# EAGLE design custom_i2c_controller (EAGLE 9.6.2)
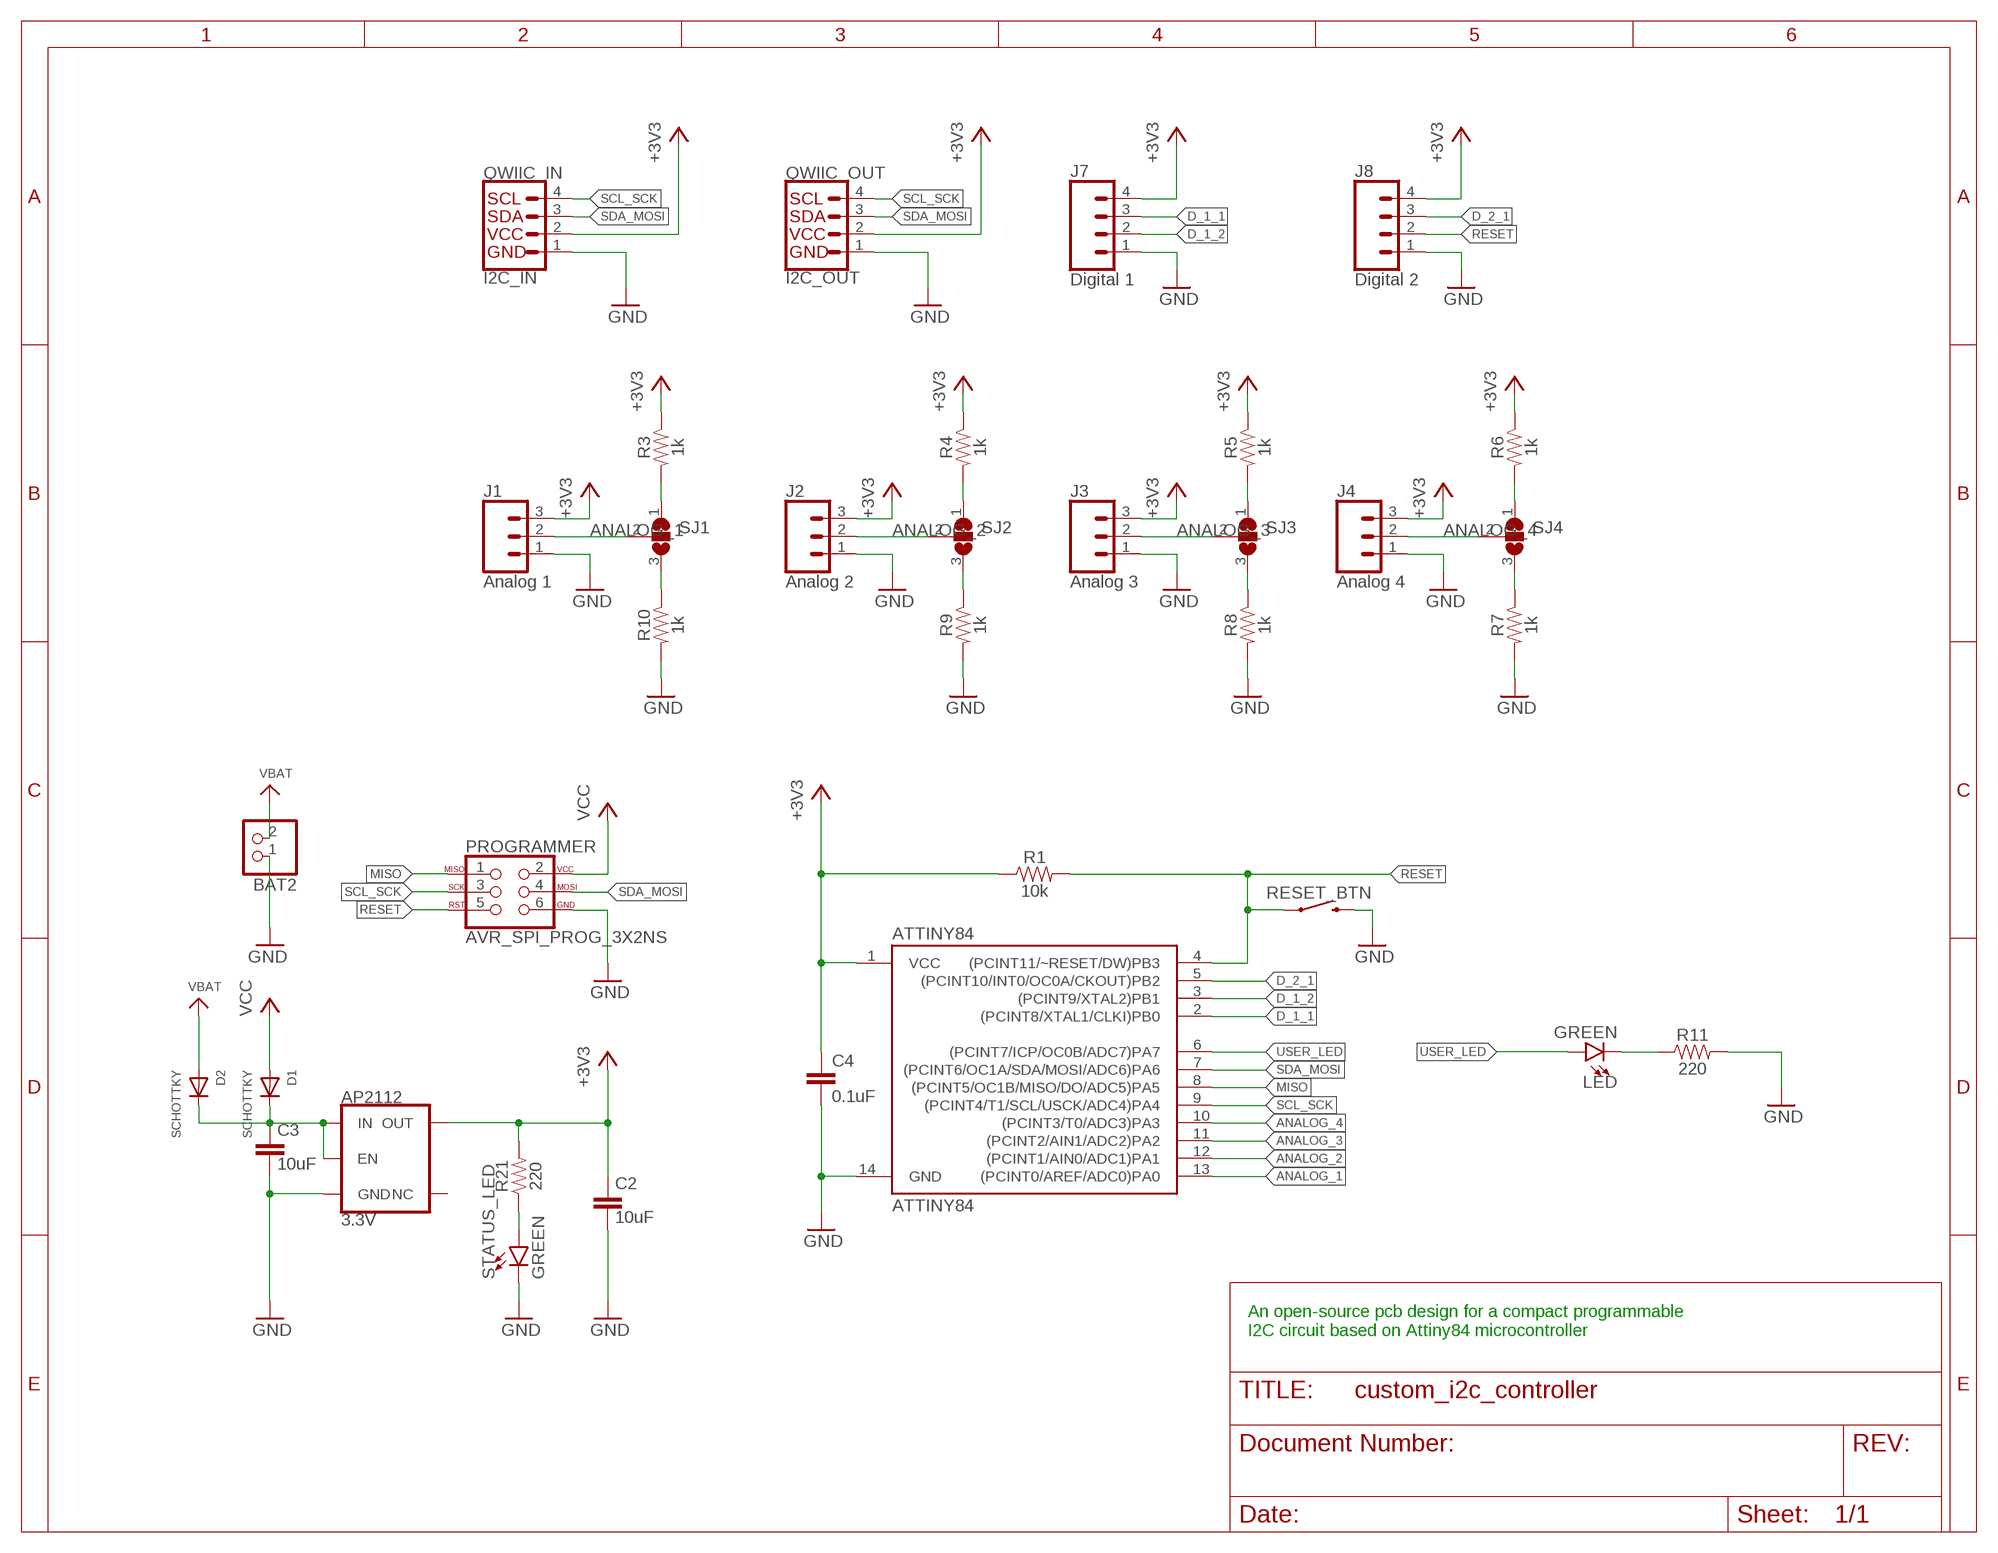
[diagram p0: schematic, sheet 1]

## Parts
AP2112  3.3V  V_REG_AP2112K-3.3V  [SOT23-5]
ATTINY84  ATTINY84  [SO14]
BAT2  CON_JST_PH_2PINSH2  [JSTSH2]
C2  10uF  10UF-1206-6.3V-20%  [1206]
C3  10uF  10UF-1206-6.3V-20%  [1206]
C4  0.1uF  0.1UF-0603-25V-5%  [0603]
D1  SCHOTTKY  DIODE_SOD-123FL  [SOD-123FL]
D2  SCHOTTKY  DIODE_SOD-123FL  [SOD-123FL]
J1  Analog 1  CONN_03  [1X03]
J2  Analog 2  CONN_03  [1X03]
J3  Analog 3  CONN_03  [1X03]
J4  Analog 4  CONN_03  [1X03]
J7  Digital 1  CONN_04  [1X04]
J8  Digital 2  CONN_04  [1X04]
LED  GREEN  LED-GREEN0603  [LED-0603]
PROGRAMMER  AVR_SPI_PROG_3X2NS  [2X3-NS]
QWIIC_IN  I2C_IN  QWIIC_CONNECTORJS-1MM  [1X04_1MM_RA]
QWIIC_OUT  I2C_OUT  QWIIC_CONNECTORJS-1MM  [1X04_1MM_RA]
R1  10k  10KOHM-0603-1/10W-1%  [0603]
R3  1k  1KOHM-0603-1/10W-1%  [0603]
R4  1k  1KOHM-0603-1/10W-1%  [0603]
R5  1k  1KOHM-0603-1/10W-1%  [0603]
R6  1k  1KOHM-0603-1/10W-1%  [0603]
R7  1k  1KOHM-0603-1/10W-1%  [0603]
R8  1k  1KOHM-0603-1/10W-1%  [0603]
R9  1k  1KOHM-0603-1/10W-1%  [0603]
R10  1k  1KOHM-0603-1/10W-1%  [0603]
R11  220  220OHM-0603-1/10W-1%  [0603]
R21  220  220OHM-0603-1/10W-1%  [0603]
RESET_BTN  MOMENTARY-SWITCH-SPST-SMD-6.0X3.5MM  [TACTILE_SWITCH_SMD_6.0X3.5MM]
SJ1  SJ2W  [SJ_2]
SJ2  SJ2W  [SJ_2]
SJ3  SJ2W  [SJ_2]
SJ4  SJ2W  [SJ_2]
STATUS_LED  GREEN  LED-GREEN0603  [LED-0603]

## Nets
+3V3: AP2112.5(OUT) ATTINY84.1(VCC) C2.1 C4.1 J1.3 J2.3 J3.3 J4.3 J7.4 J8.4 QWIIC_IN.2(VCC) QWIIC_OUT.2(VCC) R1.1 R3.1 R4.1 R5.1 R6.1 R21.2
ANALOG_1: ATTINY84.13((PCINT0/AREF/ADC0)PA0) J1.2 SJ1.2
ANALOG_2: ATTINY84.12((PCINT1/AIN0/ADC1)PA1) J2.2 SJ2.2
ANALOG_3: ATTINY84.11((PCINT2/AIN1/ADC2)PA2) J3.2 SJ3.2
ANALOG_4: ATTINY84.10((PCINT3/T0/ADC3)PA3) J4.2 SJ4.2
D_1_1: ATTINY84.2((PCINT8/XTAL1/CLKI)PB0) J7.3
D_1_2: ATTINY84.3((PCINT9/XTAL2)PB1) J7.2
D_2_1: ATTINY84.5((PCINT10/INT0/OC0A/CKOUT)PB2) J8.3
GND: AP2112.2(GND) ATTINY84.14(GND) BAT2.1 C2.2 C3.2 C4.2 J1.1 J2.1 J3.1 J4.1 J7.1 J8.1 PROGRAMMER.6 QWIIC_IN.1(GND) QWIIC_OUT.1(GND) R7.2 R8.2 R9.2 R10.2 R11.2 RESET_BTN.2 STATUS_LED.C
MISO: ATTINY84.8((PCINT5/OC1B/MISO/DO/ADC5)PA5) PROGRAMMER.1
N$1: R7.1 SJ4.3
N$2: R6.2 SJ4.1
N$3: R8.1 SJ3.3
N$4: R5.2 SJ3.1
N$5: R4.2 SJ2.1
N$6: R9.1 SJ2.3
N$7: R10.1 SJ1.3
N$8: R3.2 SJ1.1
N$9: R21.1 STATUS_LED.A
N$10: AP2112.1(IN) AP2112.3(EN) C3.1 D1.C D2.C
N$11: LED.C R11.1
RESET: ATTINY84.4((PCINT11/~RESET/DW)PB3) J8.2 PROGRAMMER.5 R1.2 RESET_BTN.1
SCL_SCK: ATTINY84.9((PCINT4/T1/SCL/USCK/ADC4)PA4) PROGRAMMER.3 QWIIC_IN.4(SCL) QWIIC_OUT.4(SCL)
SDA_MOSI: ATTINY84.7((PCINT6/OC1A/SDA/MOSI/ADC6)PA6) PROGRAMMER.4 QWIIC_IN.3(SDA) QWIIC_OUT.3(SDA)
USER_LED: ATTINY84.6((PCINT7/ICP/OC0B/ADC7)PA7) LED.A
VBAT: BAT2.2 D2.A
VCC: D1.A PROGRAMMER.2
Unconnected: AP2112.4(NC)

## Notes on the sheet
- An open-source pcb design for a compact programmable 
  I2C circuit based on Attiny84 microcontroller

## Library data of the parts
AP2112 = SparkFun-IC-Power:V_REG_AP2112: AP2112 - 600mA CMOS LDO Regulator w/ Enable The AP2112 is CMOS process low dropout linear regulator with enable function, the regulator delivers a guaranteed 600mA (min.) continuous load current. Features Output Voltage Accuracy: ±1.5% Output Current: 600mA (Min.) Foldback Short Current Protection: 50mA Enable Function to Turn ON/OFF VOUT Low Dropout Voltage (3.3V): 250mV (Typ.) @IOUT=600mA Excellent Load Regulation: 0.2%/A (Typ.) Excellent Line Regulation: 0.02%/V (Typ.) Low Quiescent Current: 55μA (Typ.) Low Standby Current: 0.01μA (Typ.) Low Output Noise: 50μVRMS PSRR: 100Hz -65dB, 1kHz -65dB OTSD Protection Stable with 1.0μF Flexible Cap: Ceramic, Tantalum and Aluminum Electrolytic Operation Temperature Range: -40°C to 85°C ESD: MM 400V, HBM 4000V; PROD_ID: VREG-12457
ATTINY84 = SparkFun-IC-Microcontroller:ATTINY84: Atmel 14-pin 2/4/8kB flash uC Datasheet <https://cdn.sparkfun.com/datasheets/Widgets/doc8006.pdf> SparkFun Products Tiny AVR Programmer <https://www.sparkfun.com/products/11801> (PGM-11801) SparkFun Servo Trigger - Continuous Rotation <https://www.sparkfun.com/products/13872> (WIG-13872) SparkFun Servo Trigger <https://www.sparkfun.com/products/13118> (WIG-13118); PROD_ID: IC-11285
BAT2 = microbuilder:CON_JST_PH_2PIN: JST 2-Pin Right-Angle Connector PH-Series - 4UConnector: 17311 SH-Series - 4UConnector: 07278
C2 C3 = SparkFun-Capacitors:10UF: 10.0µF ceramic capacitors A capacitor is a passive two-terminal electrical component used to store electrical energy temporarily in an electric field.; PROD_ID: CAP-10057
C4 = SparkFun-Capacitors:0.1UF: 0.1µF ceramic capacitors A capacitor is a passive two-terminal electrical component used to store electrical energy temporarily in an electric field.; PROD_ID: CAP-08604
D1 D2 = adafruit:DIODE: Diode SMADIODE - SMA Surface Mount Package 20V 1A Schottky Diode Digikey: 641-1014-6-ND DO-1N4148 - Through Hole Small Current Diode SOD-123 20V 1 A (.5mV Vf) Schottky Diode - Digikey: MBRX120TPMSCT-ND SOD-323 10V 570mA (.38mV Vf, 3ns) Schottky Diode - Digikey: ZLLS410CT-ND SOD-523 30V 30mA Schottky Diode (RB751S-40TE61) - Digikey: RB751S-40TE61CT-ND SOT23-R/W - SOT23 Package (R = Solder Paste/Reflow Ovens, W = Hand-Soldering) BAT54Film 40V 300mA - Digikey: 497-7162-1-ND
J1-J4 = SparkFun-Connectors:CONN_03: Multi connection point. Often used as Generic Header-pin footprint for 0.1 inch spaced/style header connections On any of the 0.1 inch spaced packages, you can populate with these: Break Away Headers - Straight <https://www.sparkfun.com/products/116> (PRT-00116) Break Away Male Headers - Right Angle <https://www.sparkfun.com/products/553> (PRT-00553) Female Headers <https://www.sparkfun.com/products/115> (PRT-00115) Break Away Headers - Machine Pin <https://www.sparkfun.com/products/117> (PRT-00117) Break Away Female Headers - Swiss Machine Pin <https://www.sparkfun.com/products/743> (PRT-00743) Stackable Header - 3 Pin (Female, 0.1") <https://www.sparkfun.com/products/13875> (PRT-13875) For SCREWTERMINALS and SPRING TERMINALS visit here: Screw Terimnals on SparkFun.com <https://www.sparkfun.com/search/results?term=Screw+Terminals> (5mm/3.5mm/2.54mm spacing) This device is also useful as a general connection point to wire up your design to another part of your project. Our various solder wires solder well into these plated through hole pads. Hook-Up Wire - Assortment (Stranded, 22 AWG) <https://www.sparkfun.com/products/11375> (PRT-11375) Hook-Up Wire - Assortment (Solid Core, 22 AWG) <https://www.sparkfun.com/products/11367> (PRT-11367) View the entire wire category on our website here <https://www.sparkfun.com/categories/141> Special notes: Molex polarized connector foot print use with SKU : PRT-08232 with associated crimp pins and housings.
J7 J8 = SparkFun-Connectors:CONN_04: Multi connection point. Often used as Generic Header-pin footprint for 0.1 inch spaced/style header connections On any of the 0.1 inch spaced packages, you can populate with these: Break Away Headers - Straight <https://www.sparkfun.com/products/116> (PRT-00116) Break Away Male Headers - Right Angle <https://www.sparkfun.com/products/553> (PRT-00553) Female Headers <https://www.sparkfun.com/products/115> (PRT-00115) Break Away Headers - Machine Pin <https://www.sparkfun.com/products/117> (PRT-00117) Break Away Female Headers - Swiss Machine Pin <https://www.sparkfun.com/products/743> (PRT-00743) For SCREWTERMINALS and SPRING TERMINALS visit here: Screw Terimnals on SparkFun.com <https://www.sparkfun.com/search/results?term=Screw+Terminals> (5mm/3.5mm/2.54mm spacing) This device is also useful as a general connection point to wire up your design to another part of your project. Our various solder wires solder well into these plated through hole pads. Hook-Up Wire - Assortment (Stranded, 22 AWG) <https://www.sparkfun.com/products/11375> (PRT-11375) Hook-Up Wire - Assortment (Solid Core, 22 AWG) <https://www.sparkfun.com/products/11367> (PRT-11367) View the entire wire category on our website here <https://www.sparkfun.com/categories/141> Special notes: Molex polarized connector foot print use with SKU : PRT-08231 with associated crimp pins and housings. 1MM SMD Version SKU: PRT-10208; PROD_ID: CONN-09696
LED STATUS_LED = SparkFun-LED:LED-GREEN: Green SMD LED Used in manufacturing of various products at SparkFun Packages: 0603 - SMD 0603 package [Product Link] <http://www.futureelectronics.com/en/technologies/semiconductors/optoelectronics/leds/Pages/9894312-LTST-C190GKT.aspx?CrossPart=HSMG-C190&IM=0> LilyPad 1206 - SMD1206 LilyPad package [Product Link] <http://www.futureelectronics.com/en/Technologies/Product.aspx?ProductID=IN150NGHARVATEKCORPORATION2049943&IM=0> 1206 - SMD1206 package [Product Link] <http://www.futureelectronics.com/en/technologies/semiconductors/optoelectronics/leds/Pages/8315665-LTST-C150KGKT.aspx?IM=0> 1206 Bottom Mount -SMD 1206 Bottom Mount [Product Link] <http://www.digikey.com/product-detail/en/lite-on-inc/LTST-C230KGKT/160-1456-1-ND/386854> SparkFun Products: Pro Mini 328 -5V <https://www.sparkfun.com/products/821> RedBoard <https://www.sparkfun.com/products/12757> MP3 Trigger <https://www.sparkfun.com/products/13720> Makey Makey <https://www.sparkfun.com/products/11076>; PROD_ID: DIO-00821
PROGRAMMER = SparkFun-Connectors:AVR_SPI_PROG_3X2: AVR ISP 6 Pin This is the reduced ISP connector for AVR programming. Common on Arduino. This footprint will take up less PCB space and can be used with a 10-pin to 6-pin adapter such as SKU: BOB-08508 **Special note about "TEST_POINT" package. The stop mask is on the top side, so if you want your programming test points to be on the bottom of your board, make sure to place this package on the bottom side of the board. This also ensure that the orientation to program from the bottom side will be correct. SparkFun Products: SparkFun ISP Pogo Adapter <https://www.sparkfun.com/products/11591> - NS Tiny AVR Programmer <https://www.sparkfun.com/products/11801> -PTH
QWIIC_IN QWIIC_OUT = SparkFun-Connectors:QWIIC_CONNECTOR: SparkFun I2C Standard Qwiic Connector An SMD 1mm pitch JST connector makes it easy and quick (get it? Qwiic?) to connect I2C devices to each other. The Qwiic system <http://www.sparkfun.com/qwiic> enables fast and solderless connection between popular platforms and various sensors and actuators. We carry 200mm <https://www.sparkfun.com/products/14204>, 100mm <https://www.sparkfun.com/products/14205>, 50mm <https://www.sparkfun.com/products/14206>, and breadboard friendly <https://www.sparkfun.com/products/14207> Qwiic cables. We also offer 10 pcs strips <https://www.sparkfun.com/products/14323> the SMD connectors.
R1 = SparkFun-Resistors:10KOHM: 10kΩ resistor A resistor is a passive two-terminal electrical component that implements electrical resistance as a circuit element. Resistors act to reduce current flow, and, at the same time, act to lower voltage levels within circuits. - Wikipedia; PROD_ID: RES-00824
R3-R10 = SparkFun-Resistors:1KOHM: 1kΩ resistor A resistor is a passive two-terminal electrical component that implements electrical resistance as a circuit element. Resistors act to reduce current flow, and, at the same time, act to lower voltage levels within circuits. - Wikipedia; PROD_ID: RES-07856
R11 R21 = SparkFun-Resistors:220OHM: 220Ω resistor A resistor is a passive two-terminal electrical component that implements electrical resistance as a circuit element. Resistors act to reduce current flow, and, at the same time, act to lower voltage levels within circuits. - Wikipedia; PROD_ID: RES-07861
RESET_BTN = SparkFun-Switches:MOMENTARY-SWITCH-SPST: Momentary Switch (Pushbutton) - SPST Normally-open (NO) SPST momentary switches (buttons, pushbuttons). Variants PTH-12MM - 12mm square, through-hole Momentary Pushbutton Switch - 12mm Square <https://www.sparkfun.com/products/9190> (COM-09190) PTH-6.0MM, PTH-6.0MM-KIT - 6.0mm square, through-hole Mini Pushbutton Switch <https://www.sparkfun.com/products/97> (COM-00097) KIT package intended for soldering kit's - only one side of pads' copper is exposed. PTH-RIGHT-ANGLE-KIT - Right-angle, through-hole Right Angle Tactile Button <https://www.sparkfun.com/products/10791> - Used on SparkFun BigTime Watch Kit <https://www.sparkfun.com/products/11734> SMD-12MM - 12mm square, surface-mount Tactile Button - SMD (12mm) <https://www.sparkfun.com/products/12993> (COM-12993) Used on SparkFun PicoBoard <https://www.sparkfun.com/products/11888> SMD-4.5MM - 4.5mm Square Trackball Switch Used on SparkFun Blackberry Trackballer Breakout <https://www.sparkfun.com/products/13169> SMD-4.6MMX2.8MM - 4.60mm x 2.80mm, surface mount Used on SparkFun SAMD21 Mini Breakout <https://www.sparkfun.com/products/13664> SMD-5.2MM, SMD-5.2-REDUNDANT - 5.2mm square, surface-mount Mini Pushbutton Switch - SMD <https://www.sparkfun.com/products/8720> (COM-08720) Used on Arduino Pro Mini <https://www.sparkfun.com/products/11114> REDUNDANT package connects both switch circuits together SMD-6.0X3.5MM - 6.0 x 3.5mm, surface mount Momentary Reset Switch SMD <https://www.sparkfun.com/products/8229> (COM-08229) SMD-6.2MM-TALL - 6.2mm square, surface mount Tactile Button - SMD (6mm) <https://www.sparkfun.com/products/12992> Used on SparkFun Digital Sandbox <https://www.sparkfun.com/products/12651> SMD-RIGHT-ANGLE - Right-angle, surface mount Used on SparkFun Block for Intel® Edison - Arduino <https://www.sparkfun.com/products/13036>; PROD_ID: SWCH-00815; SF_SKU: COM-08229
SJ1-SJ4 = jumper:SJ2W: SMD solder JUMPER

## Board
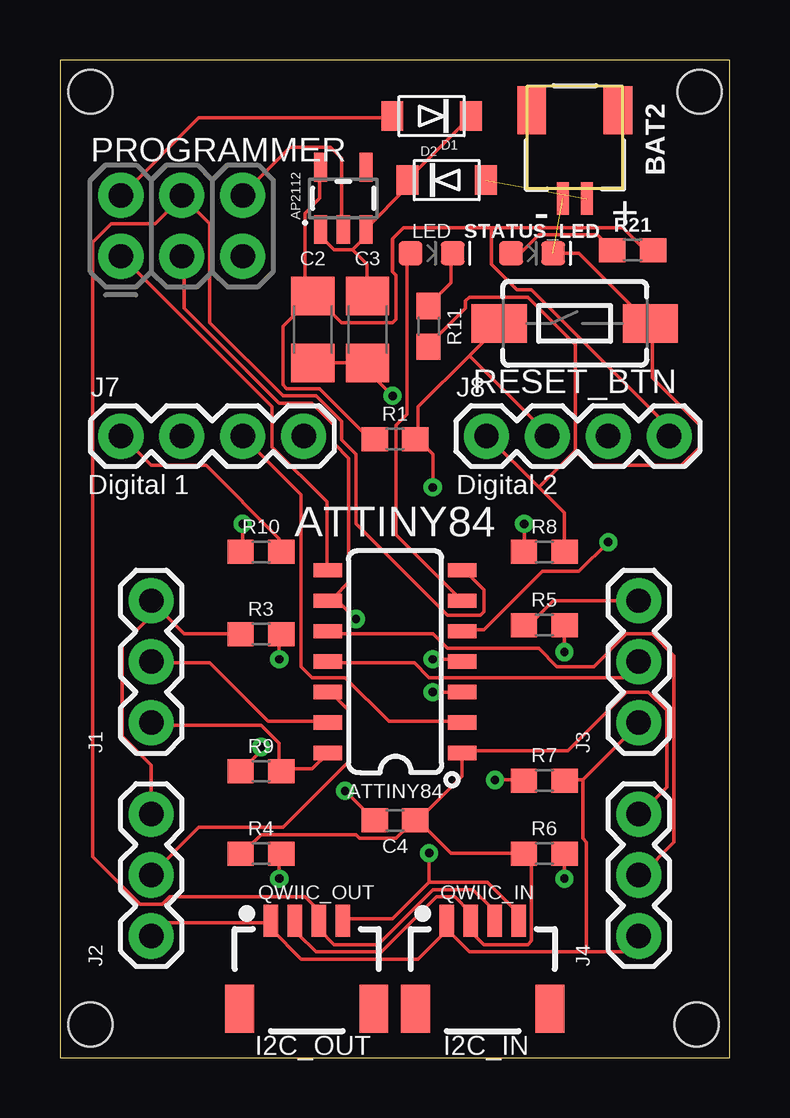
[diagram p1: board, top side]
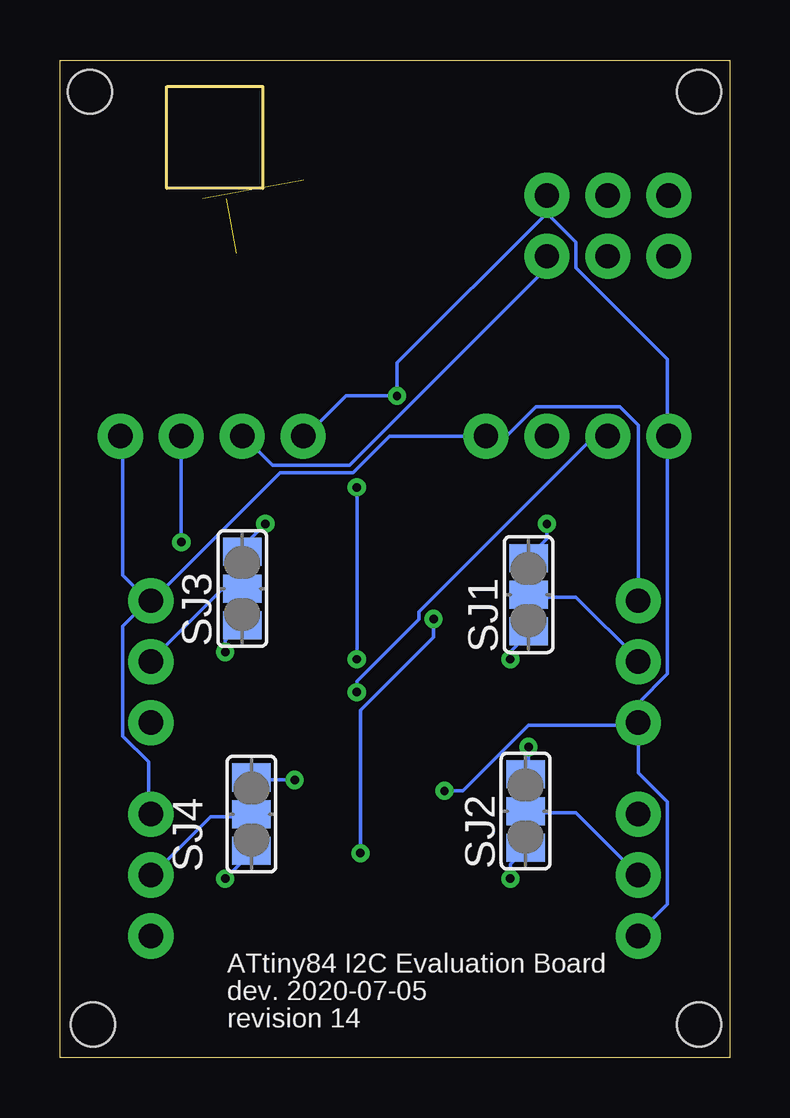
[diagram p2: board, bottom side, seen from below]

Size 27.92 x 41.58 mm. Coordinates in mm from the lower left corner, seen from the top.
Outline: 0,0 27.92,0 27.92,41.58 0,41.58 0,0
Copper layers (1*16): Top 0.035mm / dielectric 1.5mm / Bottom 0.035mm
Design rules "default": minimum track width 6mil, minimum drill 0.35mm, track to track 6mil, track to pad 6mil, pad to pad 6mil, via to via 6mil, smd to smd 6mil, copper to edge 40mil, drill to drill 6mil, minimum pad ring 10mil, minimum via ring 8mil, stop-mask expansion 4mil, vias tented up to drill 0mil, thermal gap 10mil
Holes 1.83 mm at 1.27,40.26 26.67,40.26 1.27,1.4 26.54,1.4

### Footprints (pad centres in the part's own frame; a part is rotated, then mirrored left to right if it is on the bottom)
SOT23-5 = smd 0.55 x 1.2: 1 -0.95,-1.3; 2 0,-1.3; 3 0.95,-1.3; 4 0.95,1.3; 5 -0.95,1.3
SO14 = smd 0.6 x 1.2: 1 -3.175,-2.8; 2 -1.905,-2.8; 3 -0.635,-2.8; 4 0.635,-2.8; 5 1.905,-2.8; 6 3.175,-2.8; 7 4.445,-2.8; 8 4.445,2.8; 9 3.175,2.8; 10 1.905,2.8; 11 0.635,2.8; 12 -0.635,2.8; 13 -1.905,2.8; 14 -3.175,2.8
JSTSH2 = smd 0.5 x 1.35: 1 -0.5,-2.55; 2 0.5,-2.55 | smd 1.2 x 2: NC1 -1.8,1.125; NC2 1.8,1.125
1206 = smd 1.6 x 1.8: 1 -1.4,0; 2 1.4,0
0603 = smd 1.1 x 1: 1 -0.85,0; 2 0.85,0
SOD-123FL = smd 0.91 x 1.22: A 1.637,0; C -1.637,0
1X03 = drill 1.016 pad 1.88: 1 0,0; 2 2.54,0; 3 5.08,0
1X04 = drill 1.016 pad 1.88: 1 0,0; 2 2.54,0; 3 5.08,0; 4 7.62,0
LED-0603 = smd 1 x 1: A -0.877,0; C 0.877,0
2X3-NS = drill 1.016 pad 1.88: 1 -2.54,-1.27; 2 -2.54,1.27; 3 0,-1.27; 4 0,1.27; 5 2.54,-1.27; 6 2.54,1.27
1X04_1MM_RA = smd 0.6 x 1.35: 1 -1.5,0; 2 -0.5,0; 3 0.5,0; 4 1.5,0 | smd 1.2 x 2: NC1 2.8,-3.675; NC2 -2.8,-3.675
TACTILE_SWITCH_SMD_6.0X3.5MM = smd 2.3 x 1.6: 1 -3.15,0; 2 3.15,0
SJ_2 = smd 1.168 x 1.6: 1 -1.524,0; 2 0,0; 3 1.524,0

### Placement (x,y rotation side)
AP2112  11.81,35.81 0 top
ATTINY84  13.97,15.88 90 top
BAT2  21.46,38.35 0 top
C2  10.54,30.35 270 top
C3  12.83,30.35 270 top
C4  13.97,9.91 180 top
D1  15.49,39.24 180 top
D2  16.13,36.58 0 top
J1  3.81,13.97 90 top
J2  3.81,5.08 90 top
J3  24.13,13.97 90 top
J4  24.13,5.08 90 top
J7  2.54,25.91 0 top
J8  17.78,25.91 0 top
LED  15.49,33.53 0 top
PROGRAMMER  5.08,34.67 0 top
QWIIC_IN  17.63,5.71 0 top
QWIIC_OUT  10.29,5.71 0 top
R1  13.97,25.78 0 top
R3  8.38,17.65 0 top
R4  8.38,8.51 0 top
R5  20.19,18.03 0 top
R6  20.19,8.51 0 top
R7  20.19,11.56 0 top
R8  20.19,21.08 0 top
R9  8.38,11.94 0 top
R10  8.38,21.08 0 top
R11  15.37,30.48 270 top
R21  23.88,33.66 0 top
RESET_BTN  21.46,30.61 0 top
SJ1  8.38,19.3 90 bottom
SJ2  8.51,10.29 90 bottom
SJ3  20.32,19.56 90 bottom
SJ4  19.94,10.16 90 bottom
STATUS_LED  19.68,33.53 0 top

### Tracks (layer width: path | path; a pad name or v marks a point on that pad's centre or on a via)
+3V3
  Top 0.152: 4.12,18.75 5.18,17.68 7.47,17.68 R3.1 | J2.3 3.81,12.19 2.59,13.41 2.59,17.22 4.12,18.75 | 4.12,18.75 J1.3 | R1.1 13.11,25.91 12.8,25.91 10.82,27.89 9.45,27.89 9.3,28.04 9.3,30.48 10.52,31.7 C2.1 | 17.98,34.59 14.33,34.59 13.87,34.14 13.87,32.77 14.02,32.61 14.02,30.79 13.87,30.63 11.73,30.63 10.67,31.7 C2.1 | 17.98,34.59 23.47,34.59 24.38,33.68 24.69,33.68 R21.2 | AP2112.5 10.82,37.03 10.82,35.81 10.21,35.2 10.21,32.16 10.52,31.85 C2.1 | QWIIC_OUT.2 9.91,5.64 9.91,5.18 10.67,4.42 13.41,4.42 15.7,6.71 16.46,6.71 17.07,6.1 17.07,5.79 QWIIC_IN.2 17.22,5.64 17.22,5.18 17.68,4.72 19.51,4.72 19.66,4.88 19.66,8.08 19.36,8.38 R6.1 19.2,8.53 16.31,8.53 14.94,9.91 | R4.1 7.62,8.53 8.38,9.3 12.34,9.3 12.5,9.14 14.02,9.14 14.78,9.91 C4.1 14.94,9.91 | 14.94,9.91 16.76,11.73 16.76,12.65 ATTINY84.1 16.92,12.8 21.18,12.8 23.62,15.24 24.54,15.24 25.3,14.48 25.3,11.28 24.23,10.21 J4.3 | J3.3 20.57,19.05 19.66,18.14 19.36,18.14 R5.1 | 17.98,34.59 17.98,33.07 19.05,32 19.66,32 25.3,26.36 25.3,25.91 J8.4
  Bottom 0.152: J1.3 3.81,26.36 4.57,27.13 8.08,27.13 9.3,25.91 J7.4 14.17,25.91 15.7,24.38 18.75,24.38 24.08,19.05 J3.3 24.23,19.05 | 24.23,19.05 25.3,17.98 25.3,13.41 24.23,12.34 24.23,10.21 J4.3 | 24.23,19.05 25.3,20.12 25.3,25.91 J8.4
ANALOG_1
  Top 0.152: ATTINY84.13 11.12,14.02 8.69,14.02 6.25,16.46 3.81,16.46 J1.2
  Bottom 0.152: SJ1.2 8.38,19.2 6.4,19.2 3.81,16.61 J1.2
ANALOG_2
  Top 0.152: J2.2 5.79,9.6 9.3,9.6 12.04,12.34 12.04,14.48 11.28,15.24 ATTINY84.12
  Bottom 0.152: J2.2 6.4,10.21 8.38,10.21 SJ2.2
ANALOG_3
  Top 0.152: J3.2 23.47,15.85 15.39,15.85 14.78,16.46 11.28,16.46 ATTINY84.11
  Bottom 0.152: SJ3.2 20.42,19.51 21.18,19.51 24.08,16.61 J3.2
ANALOG_4
  Top 0.152: ATTINY84.10 11.28,17.68 15.54,17.68 16.15,17.07 19.96,17.07 20.73,16.31 22.25,16.31 23.62,17.68 24.69,17.68 25.6,16.76 25.6,8.99 24.23,7.62 J4.2
  Bottom 0.152: SJ4.2 19.96,10.06 21.64,10.06 24.08,7.62 J4.2
D_1_1
  Top 0.152: J7.3 10.06,23.47 10.06,16.31 10.52,15.85 11.89,15.85 13.72,14.02 16.76,14.02 ATTINY84.2
D_1_2  (via drill 0.35)
  Top 0.152: v15.54,15.24 ATTINY84.3
  Bottom 0.152: v15.54,15.24 15.54,15.7 12.95,18.29 12.95,18.59 5.64,25.91 J7.2
D_2_1  (via drill 0.35)
  Top 0.152: v22.86,21.49 21.64,20.27 20.12,20.27 17.68,17.83 16.92,17.83 ATTINY84.5
  Bottom 0.152: J8.3 v22.86,21.49
GND  (via drill 0.35)  (1 unrouted)
  Top 0.152: ATTINY84.14 11.12,12.65 10.52,12.04 9.3,12.04 R9.2 9.14,12.04 9.14,13.11 8.38,13.87 3.81,13.87 J1.1 | v11.89,11.12 13.11,9.91 C4.2 | J2.1 3.81,5.18 4.27,5.64 8.69,5.64 QWIIC_OUT.1 8.84,5.64 8.84,5.33 10.06,4.12 14.94,4.12 16.15,5.33 | 21.79,11.58 21.18,11.58 R7.2 | 21.79,11.58 24.08,13.87 J3.1 | 16.15,5.33 16.15,5.64 QWIIC_IN.1 16.15,5.33 | 16.15,5.33 17.07,4.42 21.95,4.42 | 21.95,4.42 23.47,4.42 J4.1 | 21.79,11.58 21.79,9.14 21.95,8.99 21.95,4.42 | R10.2 9.14,21.18 9.14,21.64 6.1,24.69 3.81,24.69 2.59,25.91 J7.1 | AP2112.2 11.73,34.59 11.73,37.49 11.28,37.95 9.6,37.95 7.62,35.97 PROGRAMMER.6 | STATUS_LED.C 21.64,33.53 24.54,30.63 RESET_BTN.2 24.69,30.48 24.69,28.35 26.67,26.36 26.67,25.45 25.91,24.69 22.1,24.69 21.49,25.3 | C2.2 10.67,28.96 12.8,28.96 C3.2 12.95,28.8 12.95,28.5 v13.87,27.58 | 19.96,23.77 17.83,25.91 J8.1 | 19.96,23.77 21.03,22.71 21.03,21.18 R8.2 | 21.49,25.3 21.49,29.72 19.51,31.7 17.07,31.7 16.92,31.55 16.92,31.24 15.39,29.72 R11.2 | 19.96,23.77 21.49,25.3
  Bottom 0.152: v11.89,11.12 11.12,11.12 8.38,13.87 3.81,13.87 | 3.81,13.87 3.81,11.89 2.59,10.67 2.59,6.4 3.81,5.18 J2.1 | 3.81,13.87 J1.1 3.81,14.78 2.59,16 2.59,25.91 | J8.1 17.68,25.91 16,27.58 v13.87,27.58 13.87,28.96 7.62,35.2 | 7.62,35.2 PROGRAMMER.6 | 2.59,25.91 2.59,29.11 6.4,32.92 6.4,33.98 7.62,35.2 | 2.59,25.91 J7.1
MISO
  Top 0.152: ATTINY84.8 11.12,20.42 11.12,23.16 8.84,25.45 8.84,27.13 2.59,33.38 PROGRAMMER.1
N$1  (via drill 0.35)
  Top 0.152: v18.14,11.58 19.2,11.58 R7.1
  Bottom 0.152: v18.14,11.58 19.81,11.58 SJ4.3
N$2  (via drill 0.35)
  Top 0.152: v21.03,7.47 21.03,8.38 R6.2
  Bottom 0.152: v21.03,7.47 19.96,8.53 SJ4.1
N$3  (via drill 0.35)
  Top 0.152: v19.36,22.25 19.36,21.18 R8.1
  Bottom 0.152: v19.36,22.25 20.42,21.18 SJ3.3
N$4  (via drill 0.35)
  Top 0.152: v21.03,16.92 21.03,17.98 R5.2
  Bottom 0.152: v21.03,16.92 21.03,17.37 20.42,17.98 SJ3.1
N$5  (via drill 0.35)
  Top 0.152: v9.14,7.47 9.14,8.38 R4.2
  Bottom 0.152: v9.14,7.47 9.14,8.08 8.53,8.69 SJ2.1
N$6  (via drill 0.35)
  Top 0.152: v8.38,12.95 8.38,12.8 7.62,12.04 R9.1
  Bottom 0.152: v8.38,12.95 8.38,11.89 SJ2.3
N$7  (via drill 0.35)
  Top 0.152: v7.62,22.25 7.62,21.18 R10.1
  Bottom 0.152: v7.62,22.25 7.62,21.64 8.38,20.88 SJ1.3
N$8  (via drill 0.35)
  Top 0.152: v9.14,16.61 9.14,17.53 R3.2
  Bottom 0.152: v9.14,16.61 9.14,16.92 8.38,17.68 SJ1.1
N$9
  Top 0.152: STATUS_LED.A 19.2,33.53 19.96,34.29 22.4,34.29 23.01,33.68 R21.1
N$10
  Top 0.152: 12.19,33.68 11.43,33.68 10.97,34.14 10.97,34.44 AP2112.1 | 12.19,33.68 12.65,34.14 12.65,34.44 AP2112.3 12.8,34.59 14.48,36.27 14.48,36.58 | 14.48,36.58 17.07,39.17 D1.C | 14.48,36.58 D2.C | 12.19,33.68 12.8,33.07 12.8,31.85 C3.1
N$11
  Top 0.152: LED.C 16.31,33.53 16.31,32.31 15.39,31.39 R11.1
RESET  (via drill 0.35)
  Top 0.152: 17.07,29.26 18.29,30.48 RESET_BTN.1 | 17.07,29.26 14.94,27.13 14.94,25.91 R1.2 14.94,25.76 15.54,25.15 v15.54,23.77 | v15.54,16.61 16.76,16.61 ATTINY84.4 | 17.07,29.26 20.42,25.91 J8.2
  Bottom 0.152: v15.54,23.77 v15.54,16.61 | PROGRAMMER.5 7.62,32.92 15.85,24.69 19.05,24.69 20.27,25.91 J8.2
SCL_SCK  (via drill 0.35)
  Top 0.152: 15.39,7.32 13.87,5.79 11.89,5.79 QWIIC_OUT.4 | 15.39,7.32 17.83,7.32 19.05,6.1 19.05,5.79 QWIIC_IN.4 | 11.43,19.2 12.04,19.81 12.04,24.99 11.43,25.6 11.43,26.36 10.52,27.28 9.14,27.28 5.18,31.24 5.18,33.38 PROGRAMMER.3 | 11.43,19.2 11.28,19.05 ATTINY84.9 11.43,19.2 | v15.39,8.53 15.39,7.32 | 11.43,19.2 v12.34,18.29
  Bottom 0.152: v15.39,8.53 15.39,14.48 12.34,17.53 v12.34,18.29
SDA_MOSI
  Top 0.152: QWIIC_IN.3 17.98,5.79 17.98,6.25 17.22,7.01 15.54,7.01 13.26,4.72 11.43,4.72 10.82,5.33 10.82,5.64 QWIIC_OUT.3 10.67,5.79 10.67,6.25 10.21,6.71 4.57,6.71 4.27,6.4 3.35,6.4 1.37,8.38 1.37,33.98 2.13,34.75 3.96,34.75 5.03,35.81 PROGRAMMER.4 5.18,35.81 6.25,34.75 6.25,30.63 9.3,27.58 10.67,27.58 11.73,26.52 11.73,25.76 12.34,25.15 12.34,22.25 16.15,18.44 17.53,18.44 17.68,18.59 17.68,19.51 16.92,20.27 ATTINY84.7
USER_LED
  Top 0.152: LED.A 14.48,33.53 14.48,26.82 14.02,26.36 14.02,21.79 ATTINY84.6
VBAT  (1 unrouted)
VCC
  Top 0.152: D1.A 13.72,39.17 5.79,39.17 2.59,35.97 PROGRAMMER.2

### Text on the board
bNames: ATtiny84 I2C Evaluation Board | dev. 2020-07-05 | revision 14